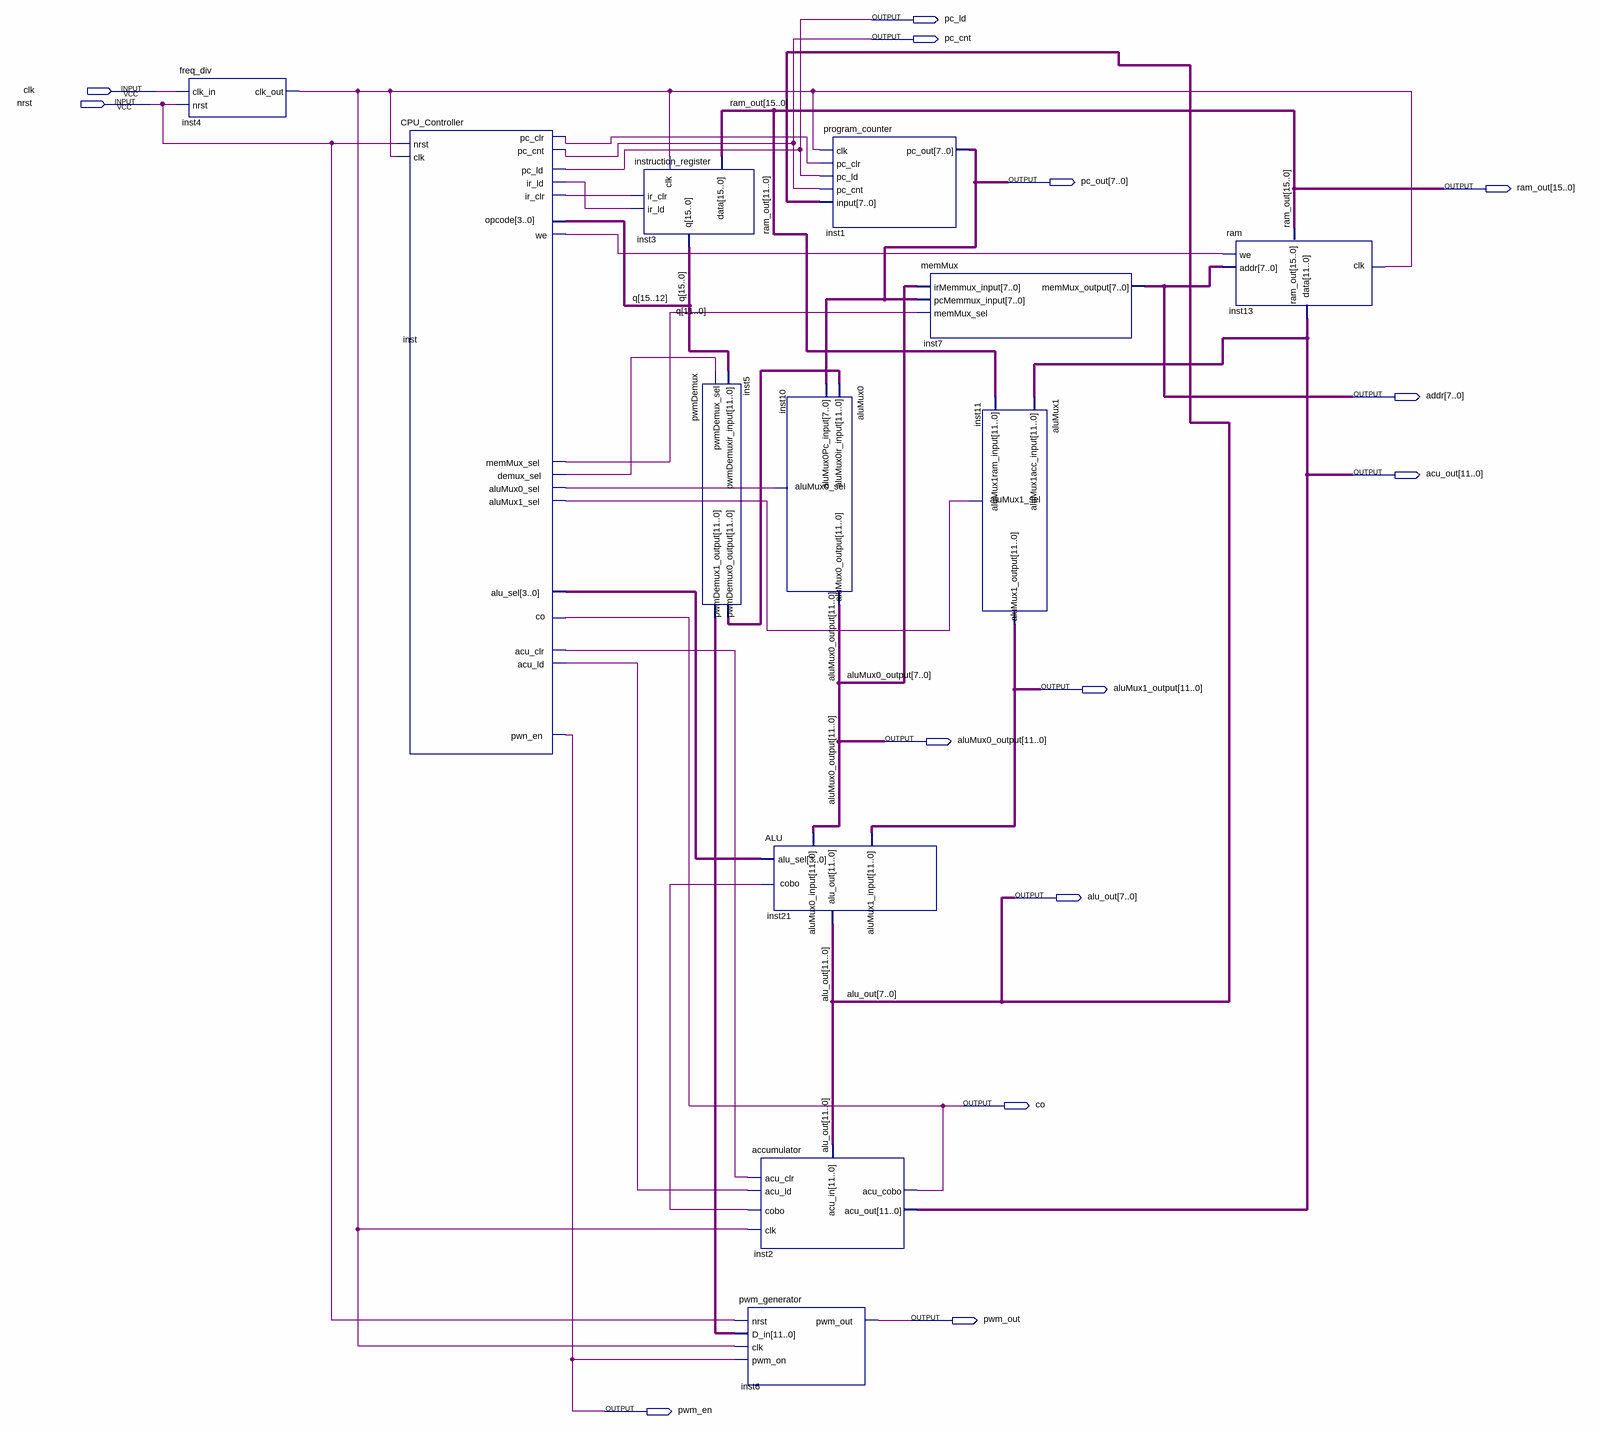
[diagram p0: schematic sheet]
// Quartus schematic RBCPU_16bit.bdf as structural Verilog: 12 symbols, 14 pins
module RBCPU_16bit (
  input  clk,
  input  nrst,
  output pc_ld,
  output pc_cnt,
  output [7:0] pc_out,
  output [15:0] ram_out,
  output [7:0] addr,
  output [11:0] acu_out,
  output [11:0] aluMux1_output,
  output [11:0] aluMux0_output,
  output [11:0] alu_out,
  output co,
  output pwm_out,
  output pwm_en
);

  wire inst4_clk_out, inst21_cobo, inst_acu_clr, inst_acu_ld, inst_alumux0_sel, inst_alumux1_sel,
       inst_demux_sel, inst_ir_clr, inst_ir_ld, inst_memmux_sel, inst_pc_clr, inst_we;
  wire [3:0] inst_alu_sel;
  wire [11:0] inst5_pwmdemux0_output, inst5_pwmdemux1_output;
  wire [15:0] q;

  freq_div inst4 (.clk_in(clk), .nrst(nrst), .clk_out(inst4_clk_out));
  CPU_Controller inst (
    .nrst(nrst), .clk(inst4_clk_out), .co(co), .opcode(q[15:12]), .pc_cnt(pc_cnt), .pc_ld(pc_ld),
    .pwn_en(pwm_en), .ir_ld(inst_ir_ld), .ir_clr(inst_ir_clr), .we(inst_we), .memMux_sel(inst_memmux_sel),
    .demux_sel(inst_demux_sel), .aluMux0_sel(inst_alumux0_sel), .aluMux1_sel(inst_alumux1_sel),
    .acu_ld(inst_acu_ld), .acu_clr(inst_acu_clr), .pc_clr(inst_pc_clr), .alu_sel(inst_alu_sel));
  instruction_register inst3 (.clk(inst4_clk_out), .ir_clr(inst_ir_clr), .ir_ld(inst_ir_ld), .data(ram_out), .q(q));
  pwmDemux inst5 (
    .pwmDemuxir_input(q[11:0]), .pwmDemux_sel(inst_demux_sel), .pwmDemux0_output(inst5_pwmdemux0_output),
    .pwmDemux1_output(inst5_pwmdemux1_output));
  accumulator inst2 (
    .clk(inst4_clk_out), .acu_clr(inst_acu_clr), .acu_ld(inst_acu_ld), .cobo(inst21_cobo), .acu_in(alu_out),
    .acu_cobo(co), .acu_out(acu_out));
  pwm_generator inst6 (
    .nrst(nrst), .D_in(inst5_pwmdemux1_output), .clk(inst4_clk_out), .pwm_on(pwm_en), .pwm_out(pwm_out));
  aluMux0 inst10 (
    .aluMux0ir_input(inst5_pwmdemux0_output), .aluMux0Pc_input(pc_out), .aluMux0_sel(inst_alumux0_sel),
    .aluMux0_output(aluMux0_output));
  ALU inst21 (
    .alu_sel(inst_alu_sel), .aluMux0_input(aluMux0_output), .aluMux1_input(aluMux1_output),
    .cobo(inst21_cobo), .alu_out(alu_out));
  program_counter inst1 (
    .clk(inst4_clk_out), .pc_clr(inst_pc_clr), .pc_ld(pc_ld), .pc_cnt(pc_cnt), .\input (alu_out[7:0]),
    .pc_out(pc_out));
  memMux inst7 (
    .irMemmux_input(aluMux0_output[7:0]), .pcMemmux_input(pc_out), .memMux_sel(inst_memmux_sel),
    .memMux_output(addr));
  aluMux1 inst11 (
    .aluMux1acc_input(acu_out), .aluMux1ram_input(ram_out[11:0]), .aluMux1_sel(inst_alumux1_sel),
    .aluMux1_output(aluMux1_output));
  ram inst13 (.data(acu_out), .addr(addr), .we(inst_we), .clk(inst4_clk_out), .ram_out(ram_out));
endmodule
